# Altium schematic sheet ai cam1_Sheet_1.schdoc
size 845 x 599 mm; Name: A_A1; Symbol: A_A1; Device: A_A1; @Project Name: Sheet_1; REV: 1.0; Date: 2024-08-16; Sheet: 1/1; Draw By: kenchen9508; Company: Your Company; Convert to PCB: yes; Add into BOM: yes; @Page No: 1; @Page Count: 1; @Schematic Name: ai cam; @Board Name: ai cam; @Update Date: 2024-08-17; @Page Name: Sheet_1; @Create Time: 21:37:35; @Update Time: 14:32:11; @Create Date: 2024-08-16
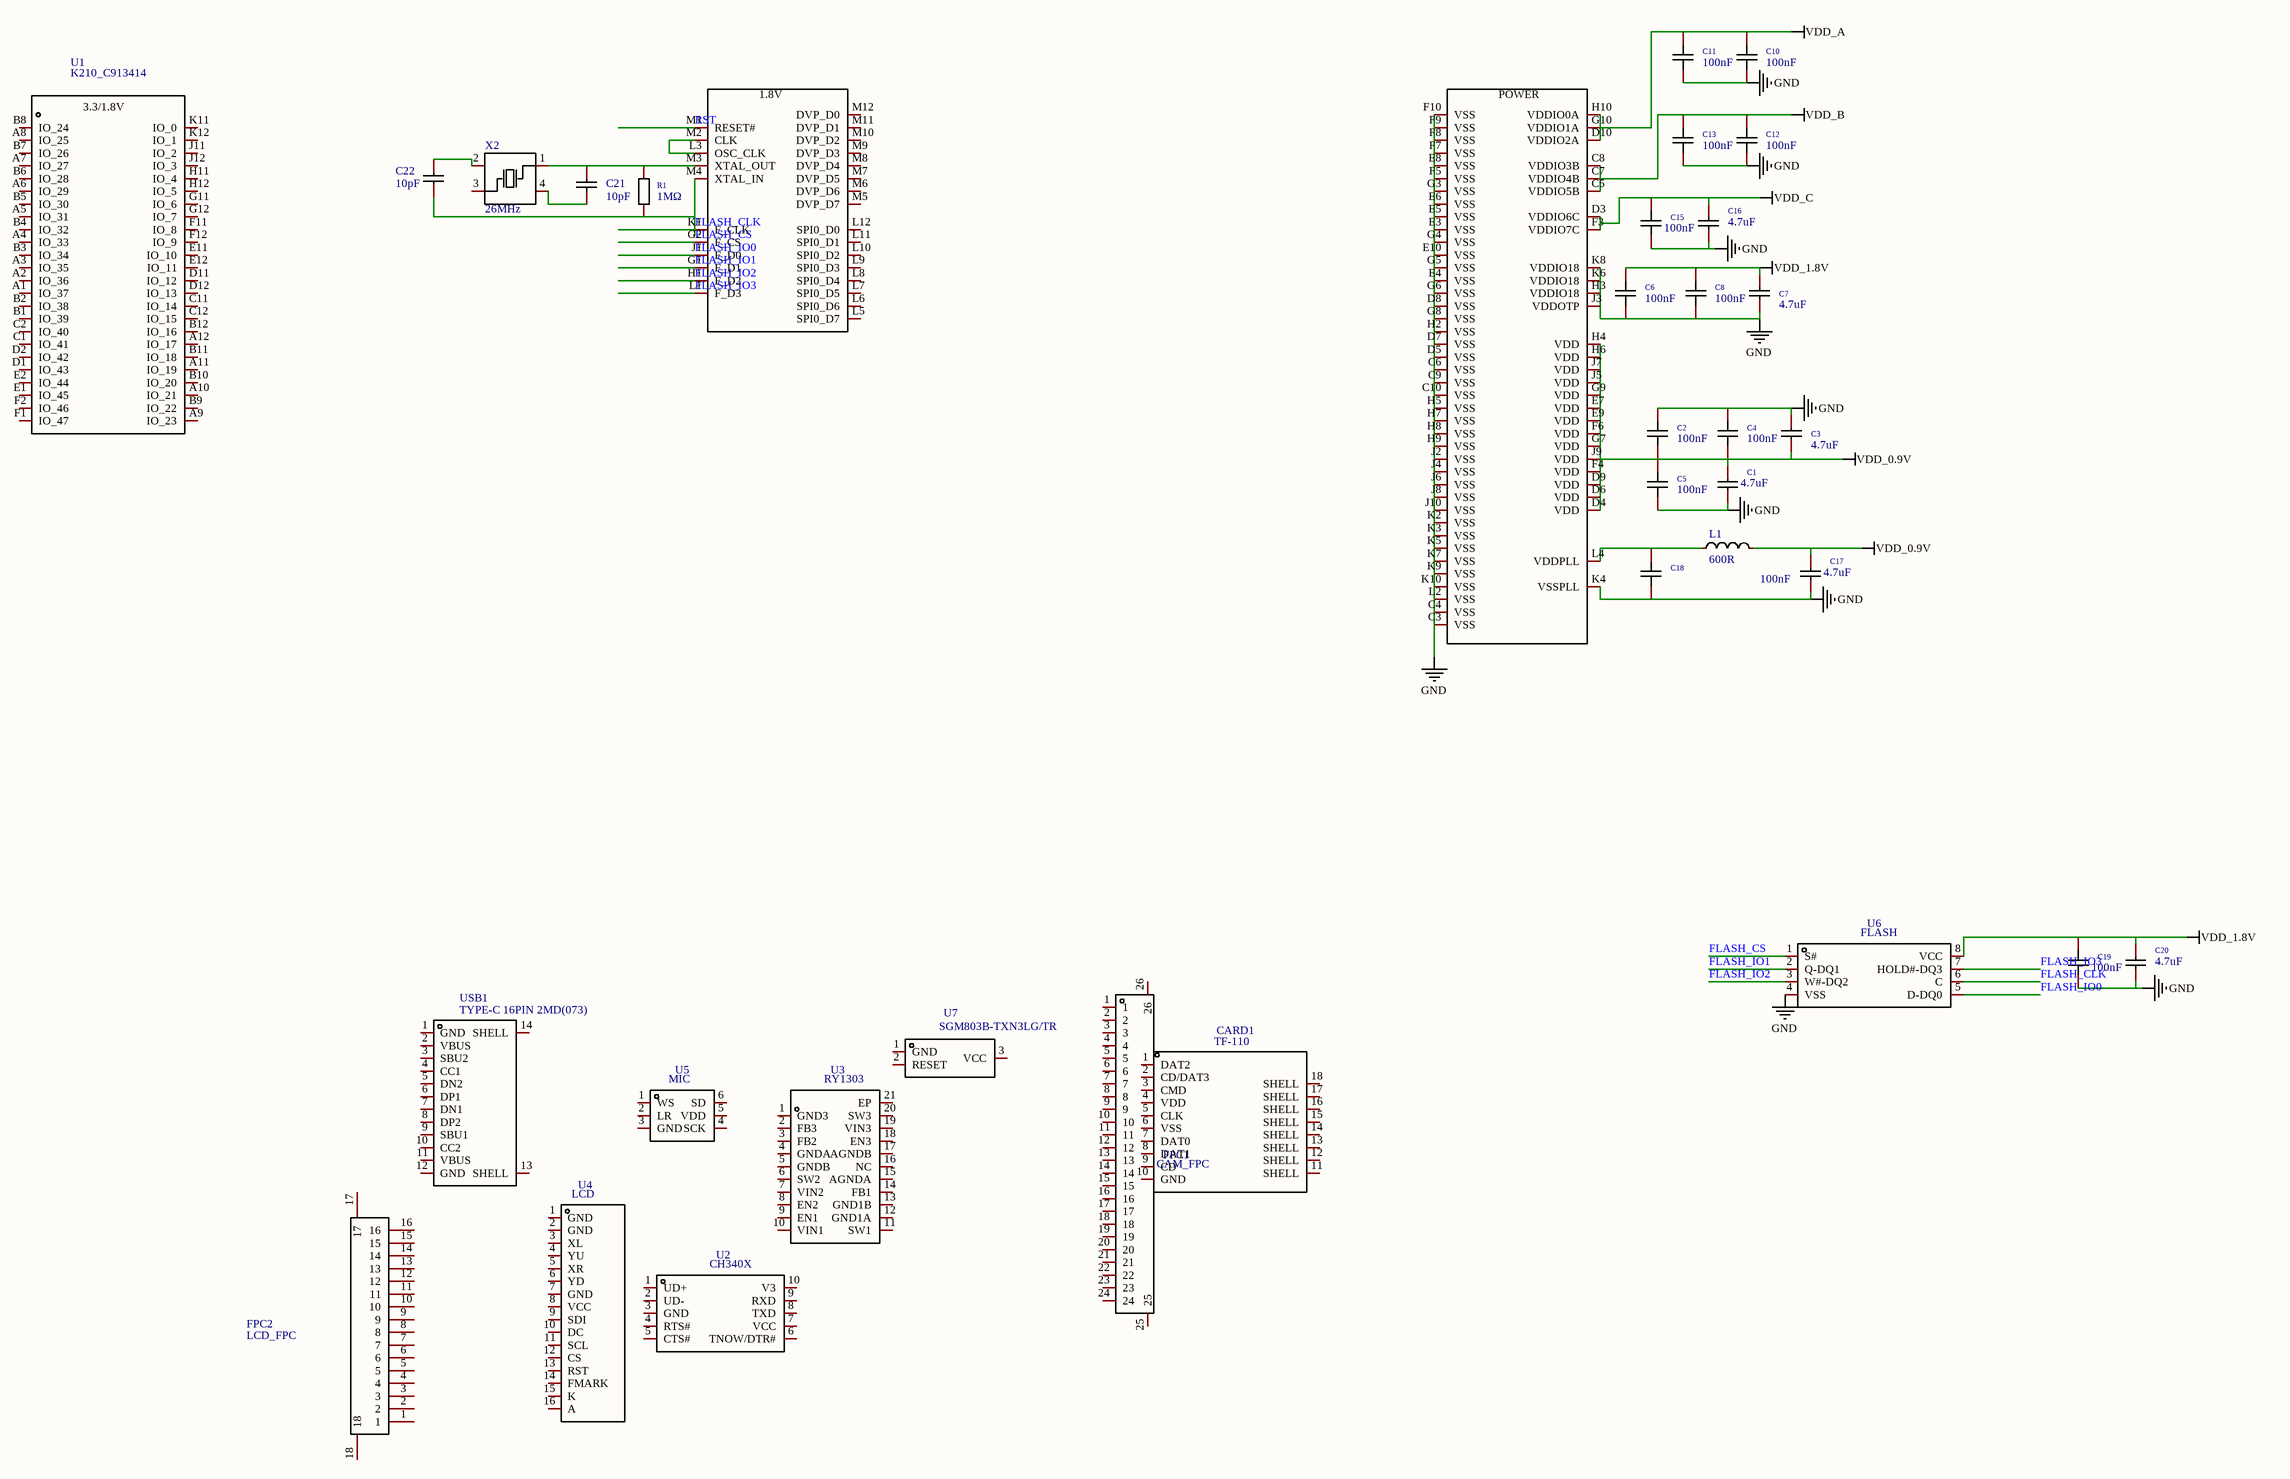
[diagram p0: ai cam1_Sheet_1.schdoc]

## Parts
C1  4.7uF  [C0402]  (value not drawn)
C2  100nF  [C0402]  (value not drawn)
C3  4.7uF  [C0402]  (value not drawn)
C4  100nF  [C0402]  (value not drawn)
C5  100nF  [C0402]  (value not drawn)
C6  100nF  [C0402]  (value not drawn)
C7  4.7uF  [C0402]  (value not drawn)
C8  100nF  [C0402]  (value not drawn)
C10  100nF  [C0402]  (value not drawn)
C11  100nF  [C0402]  (value not drawn)
C12  100nF  [C0402]  (value not drawn)
C13  100nF  [C0402]  (value not drawn)
C15  100nF  [C0402]  (value not drawn)
C16  4.7uF  [C0402]  (value not drawn)
C17  4.7uF  [C0402]  (value not drawn)
C18  100nF  [C0402]  (value not drawn)
C19  100nF  [C0402]  (value not drawn)
C20  4.7uF  [C0402]  (value not drawn)
C21  10pF  [C0402]  (value not drawn)
C22  10pF  [C0402]  (value not drawn)
CARD1  TF-110  (value not drawn)
FPC1  CAM_FPC  (value not drawn)
FPC2  LCD_FPC  (value not drawn)
L1  600R  [L0402]  (value not drawn)
R1  1MΩ  [R0402]  (value not drawn)
U1  K210_C913414  (value not drawn)
U2  CH340X  (value not drawn)
U3  RY1303  (value not drawn)
U4  LCD  (value not drawn)
U5  MIC  (value not drawn)
U6  FLASH  (value not drawn)
U7  SGM803B-TXN3LG/TR  (value not drawn)
USB1  TYPE-C 16PIN 2MD(073)  (value not drawn)
X2  26MHz  (value not drawn)

## Nets
GND: C1.1 C2.2 C3.2 C4.2 C5.1 C6.1 C7.1 C8.1 C10.1 C11.1 C12.1 C13.1 C15.1 C16.1 C17.1 C18.1 C19.1 C20.1 U1.C3(VSS) U1.C4(VSS) U1.C6(VSS) U1.C9(VSS) U1.C10(VSS) U1.D5(VSS) U1.D7(VSS) U1.D8(VSS) U1.E3(VSS) U1.E4(VSS) U1.E5(VSS) U1.E6(VSS) U1.E8(VSS) U1.E10(VSS) U1.F5(VSS) U1.F7(VSS) U1.F8(VSS) U1.F9(VSS) U1.F10(VSS) U1.G3(VSS) U1.G4(VSS) U1.G5(VSS) U1.G6(VSS) U1.G8(VSS) U1.H2(VSS) U1.H3(VDDIO18) U1.H5(VSS) U1.H7(VSS) U1.H8(VSS) U1.H9(VSS) U1.J2(VSS) U1.J3(VDDOTP) U1.J4(VSS) U1.J6(VSS) U1.J8(VSS) U1.J10(VSS) U1.K2(VSS) U1.K3(VSS) U1.K4(VSSPLL) U1.K5(VSS) U1.K6(VDDIO18) U1.K7(VSS) U1.K8(VDDIO18) U1.K9(VSS) U1.K10(VSS) U1.L2(VSS) U6.4(VSS)
VDD_0.9V: C1.2 C2.1 C3.1 C4.1 C5.2 C17.2 L1.2 U1.D4(VDD) U1.D6(VDD) U1.D9(VDD) U1.E7(VDD) U1.E9(VDD) U1.F4(VDD) U1.F6(VDD) U1.G7(VDD) U1.G9(VDD) U1.H4(VDD) U1.H6(VDD) U1.J5(VDD) U1.J7(VDD) U1.J9(VDD)
VDD_1.8V: C6.2 C7.2 C8.2 C19.2 C20.2 U6.8(VCC)
VDD_A: C10.2 C11.2 U1.D10(VDDIO2A) U1.G10(VDDIO1A) U1.H10(VDDIO0A)
VDD_B: C12.2 C13.2 U1.C5(VDDIO5B) U1.C7(VDDIO4B) U1.C8(VDDIO3B)
VDD_C: C15.2 C16.2 U1.D3(VDDIO6C) U1.F3(VDDIO7C)
FLASH_CLK: C22.1 R1.1 U1.K1(F_CLK) U1.M4(XTAL_IN) U6.6(C)
FLASH_CS: U1.G2(F_CS) U6.1(S#)
FLASH_IO0: U1.J1(F_D0) U6.5(D-DQ0)
FLASH_IO1: U1.G1(F_D1) U6.2(Q-DQ1)
FLASH_IO2: U1.H1(F_D2) U6.3(W#-DQ2)
FLASH_IO3: U1.L1(F_D3) U6.7(HOLD#-DQ3)
RST: U1.M1(RESET#)
NetC18_2: C18.2 L1.1 U1.L4(VDDPLL)
NetC21_1: C21.1 X2.4(GND)
NetC21_2: C21.2 R1.2 U1.M3(XTAL_OUT) X2.1(OSC1)
NetC22_2: C22.2 X2.2(GND)
NetU1_L3: U1.L3(OSC_CLK) U1.M2(CLK)

Not connected (* = marked no-connect by the designer): CARD1 1(DAT2) 2(CD/DAT3) 3(CMD) 4(VDD) 5(CLK) 6(VSS) 7(DAT0) 8(DAT1) 9(CD) 10(GND) 11(SHELL) 12(SHELL) 13(SHELL) 14(SHELL) 15(SHELL) 16(SHELL) 17(SHELL) 18(SHELL); FPC1 1 2 3 4 5 6 7 8 9 10 11 12 13 14 15 16 17 18 19 20 21 22 23 24 25 26; FPC2 1 2 3 4 5 6 7 8 9 10 11 12 13 14 15 16 17 18; U1 A1(IO_37) A2(IO_36) A3(IO_35) A4(IO_33) A5(IO_31) A6(IO_29) A7(IO_27) A8(IO_25) A9(IO_23) A10(IO_21) A11(IO_19) A12(IO_17) B1(IO_39) B2(IO_38) B3(IO_34) B4(IO_32) B5(IO_30) B6(IO_28) B7(IO_26) B8(IO_24) B9(IO_22) B10(IO_20) B11(IO_18) B12(IO_16) C1(IO_41) C2(IO_40) C11(IO_14) C12(IO_15) D1(IO_43) D2(IO_42) D11(IO_12) D12(IO_13) E1(IO_45) E2(IO_44) E11(IO_10) E12(IO_11) F1(IO_47) F2(IO_46) F11(IO_8) F12(IO_9) G11(IO_6) G12(IO_7) H11(IO_4) H12(IO_5) J11(IO_2) J12(IO_3) K11(IO_0) K12(IO_1) L5(SPI0_D7) L6(SPI0_D6) L7(SPI0_D5) L8(SPI0_D4) L9(SPI0_D3) L10(SPI0_D2) L11(SPI0_D1) L12(SPI0_D0) M5(DVP_D7) M6(DVP_D6) M7(DVP_D5) M8(DVP_D4) M9(DVP_D3) M10(DVP_D2) M11(DVP_D1) M12(DVP_D0); U2 1(UD+) 2(UD-) 3(GND) 4(RTS#) 5(CTS#) 6(TNOW/DTR#) 7(VCC) 8(TXD) 9(RXD) 10(V3); U3 1(GND3) 2(FB3) 3(FB2) 4(GNDA) 5(GNDB) 6(SW2) 7(VIN2) 8(EN2) 9(EN1) 10(VIN1) 11(SW1) 12(GND1A) 13(GND1B) 14(FB1) 15(AGNDA) 16(NC) 17(AGNDB) 18(EN3) 19(VIN3) 20(SW3) 21(EP); U4 1(GND) 2(GND) 3(XL) 4(YU) 5(XR) 6(YD) 7(GND) 8(VCC) 9(SDI) 10(DC) 11(SCL) 12(CS) 13(RST) 14(FMARK) 15(K) 16(A); U5 1(WS) 2(LR) 3(GND) 4(SCK) 5(VDD) 6(SD); U7 1(GND) 2(RESET) 3(VCC); USB1 1(GND) 2(VBUS) 3(SBU2) 4(CC1) 5(DN2) 6(DP1) 7(DN1) 8(DP2) 9(SBU1) 10(CC2) 11(VBUS) 12(GND) 13(SHELL) 14(SHELL); X2 3(OSC2)

## Notes on the sheet
- 1
- 2
- 3
- 4
- 5
- 6
- 7
- 8
- 9
- 10
- 11
- 12
- 13
- 14
- 15
- 16
- A
- B
- C
- D
- E
- F
- G
- H
- I
- J
- K
- TITLE:
- Sheet_1
- REV:
- 1.0
- Date:
- Company:
- 2024-08-16
- Your Company
- Drawn By:
- kenchen9508
- Sheet:
- 1/1
- (in symbol K210_C913414) 1.8V; POWER; 3.3/1.8V

## Library data of the parts
C1 C3 C7 C16 C17 C20 = CL05A475MP5NRNC: Capacitance: Tolerance:±20% Tolerance:±20% Voltage Rated: Temperature Coefficient:; Manufacturer: SAMSUNG(三星); Add into BOM: yes; Tolerance: ±20%; Symbol: CL05A475MP5NRNC; Device: CL05A475MP5NRNC; Supplier: LCSC; Manufacturer Part: CL05A475MP5NRNC; Value: 4.7uF; Supplier Part: C23733; LCSC Part Name: 4.7uF ±20% 10V; Supplier Footprint: 0402; Datasheet: https://atta.szlcsc.com/upload/public/pdf/source/20160218/1457707763339.pdf; Convert to PCB: yes
C2 C4-C6 C8 C10-C13 C15 C18 C19 = CC0402KRX7R7BB104: Capacitance: Tolerance:±10% Tolerance:±10% Voltage Rated: Temperature Coefficient:; Manufacturer: YAGEO(国巨); Add into BOM: yes; Tolerance: ±10%; Symbol: CC0402KRX7R7BB104; Device: CC0402KRX7R7BB104; Supplier: LCSC; Manufacturer Part: CC0402KRX7R7BB104; Value: 100nF; Supplier Part: C60474; JLCPCB Part Class: 扩展库; LCSC Part Name: 100nF ±10% 16V; Supplier Footprint: 0402; Datasheet: https://atta.szlcsc.com/upload/public/pdf/source/20211223/9278FD768280B81DDBEF48FA36411A03.pdf; Convert to PCB: yes
C21 C22 = 0402CG100J500NT: Capacitance: Tolerance:±5% Tolerance:±5% Voltage Rated: Temperature Coefficient:; Manufacturer: FH(风华); Add into BOM: yes; Tolerance: ±5%; Symbol: 0402CG100J500NT; Device: 0402CG100J500NT; LCSC Part Name: 10pF ±5% 50V; Supplier Part: C1545; Manufacturer Part: 0402CG100J500NT; Supplier Footprint: 0402; Datasheet: https://atta.szlcsc.com/upload/public/pdf/source/20200305/C486355_26A10D38EF8C2A5C37091D0039909270.pdf; Supplier: LCSC; Convert to PCB: yes; Value: 10pF
CARD1 = TF-110: Manufacturer: XUNPU(讯普); Convert to PCB: yes; Origin Footprint: TF-SMD_TF-110; Symbol: TF-110; Device: TF-110; Supplier: LCSC; Supplier Part: C266613; Manufacturer Part: TF-110; JLCPCB Part Class: Extended Part; Add into BOM: yes
FPC1 = CAM_FPC: Manufacturer: XUNPU(讯普); Manufacturer Part: FPC-05FB-24PH20; Convert to PCB: yes; Origin Footprint: FPC-SMD_24P-P0.50_FPC-05FB-24PH20; Symbol: CAM_FPC; Device: CAM_FPC; Supplier: LCSC; Supplier Part: C2856831; JLCPCB Part Class: Extended Part; Add into BOM: yes
FPC2 = LCD_FPC: Manufacturer: JS(钜硕电子); Manufacturer Part: AFC01-S16FCA-00; Convert to PCB: yes; Origin Footprint: FPC-SMD_P0.50-16P_FGS-XJ-H2.0; Symbol: LCD_FPC; Device: LCD_FPC; Supplier: LCSC; Supplier Part: C262665; JLCPCB Part Class: Extended Part; Add into BOM: yes
L1 = BLM15AG601SN1D: Impedance @ Frequency:600Ω@100MHz Tolerance:±25% Tolerance:±25% DC Resistance:520mΩ Current Rating:300mA Circuits:1; Manufacturer: muRata(村田); Add into BOM: yes; Tolerance: ±25%; DC Resistance: 520mΩ; Current Rating: 300mA; Circuits: 1; Symbol: BLM15AG601SN1D; Device: BLM15AG601SN1D; LCSC Part Name: 单路 0402磁珠 阻抗600Ω@100MHz; Supplier Part: C76884; Manufacturer Part: BLM15AG601SN1D; Supplier Footprint: 0402; JLCPCB Part Class: 扩展库; Datasheet: https://atta.szlcsc.com/upload/public/pdf/source/20181120/C333978_3E581FB55966932B05020139ABDE8E01.pdf; Supplier: LCSC; Convert to PCB: yes; Impedance @ Frequency: 600Ω@100MHz
R1 = 0402WGF1004TCE: Type:Thick Film Resistors Resistance:1MΩ Tolerance:±1% Tolerance:±1% Power(Watts): Overload Voltage (Max): Temperature Coefficient:±100ppm/℃ Temperature Coefficient:±100ppm/℃ Operating Temperature Range:-55℃~+155℃ Operating Temperature Range:-55℃~+155℃; Manufacturer: UNI-ROYAL(厚声); Add into BOM: yes; Tolerance: ±1%; Symbol: 0402WGF1004TCE; Device: 0402WGF1004TCE; Supplier: LCSC; Manufacturer Part: 0402WGF1004TCE; Supplier Part: C26083; Value: 1MΩ; JLCPCB Part Class: 基础库; LCSC Part Name: 1MΩ ±1% 62.5mW 厚膜电阻; Supplier Footprint: 0402; Datasheet: https://atta.szlcsc.com/upload/public/pdf/source/20200306/C422600_1E6D84923E4A46A82E41ADD87F860B5C.pdf; Convert to PCB: yes; Type: Thick Film Resistors; Temperature Coefficient: ±100ppm/℃; Operating Temperature Range: -55℃~+155℃
U1 = K210_C913414: Manufacturer: Canaan(嘉楠); Manufacturer Part: k210; Convert to PCB: yes; Origin Footprint: BGA-144_L8.0-W8.0-R12-C12-P0.65-BL; Symbol: K210_C913414; Device: K210_C913414; Supplier: LCSC; Supplier Part: C913414; JLCPCB Part Class: Extended Part; Add into BOM: yes
U2 = CH340X: Manufacturer: WCH(南京沁恒); Convert to PCB: yes; Origin Footprint: MSOP-10_L3.0-W3.0-P0.50-LS5.0-BL; Symbol: CH340X; Device: CH340X; Supplier: LCSC; Supplier Part: C3035748; Manufacturer Part: CH340X; JLCPCB Part Class: Extended Part; Add into BOM: yes
U3 = RY1303: Manufacturer: RYCHiP(蕊源); Convert to PCB: yes; Origin Footprint: QFN-20_L3.0-W3.0-P0.40-BL-EP1.9; Symbol: RY1303; Device: RY1303; Supplier: LCSC; Supplier Part: C370881; Manufacturer Part: RY1303; JLCPCB Part Class: Extended Part; Add into BOM: yes
U4 = LCD: Manufacturer: HS(汉昇); Manufacturer Part: HS24CG003-ARX; Convert to PCB: yes; Origin Footprint: LCD-SMD_HS24CG003-ARX; Symbol: LCD; Device: LCD; Supplier: LCSC; Supplier Part: C5329583; JLCPCB Part Class: Extended Part; Add into BOM: yes
U5 = MIC: Manufacturer: TDK InvenSense(应美盛); Manufacturer Part: ICS-43434; Convert to PCB: yes; Origin Footprint: MIC-SMD_6P-L3.5-W2.7-P0.90-BL; Symbol: MIC; Device: MIC; Supplier: LCSC; Supplier Part: C5656610; JLCPCB Part Class: Extended Part; Add into BOM: yes
U6 = FLASH: Manufacturer: ST(意法半导体); Manufacturer Part: M95P32-IXMNT/E; Convert to PCB: yes; Origin Footprint: SO-8_L4.9-W3.9-P1.27-LS6.0-BL; Symbol: FLASH; Device: FLASH; Supplier: LCSC; Supplier Part: C5267629; JLCPCB Part Class: Extended Part; Add into BOM: yes
U7 = SGM803B-TXN3LG/TR: Manufacturer: SGMICRO(圣邦微); Convert to PCB: yes; Origin Footprint: SOT-23-3_L2.9-W1.3-P0.95-LS2.4-BR; Symbol: SGM803B-TXN3LG/TR; Device: SGM803B-TXN3LG/TR; Supplier: LCSC; Supplier Part: C699599; Manufacturer Part: SGM803B-TXN3LG/TR; JLCPCB Part Class: Extended Part; Add into BOM: yes
USB1 = TYPE-C 16PIN 2MD(073): Manufacturer: SHOU HAN(首韩); Convert to PCB: yes; Origin Footprint: USB-C-SMD_TYPE-C-6PIN-2MD-073; Symbol: TYPE-C 16PIN 2MD(073); Device: TYPE-C 16PIN 2MD(073); Supplier: LCSC; Supplier Part: C2765186; Manufacturer Part: TYPE-C 16PIN 2MD(073); JLCPCB Part Class: Extended Part; Add into BOM: yes
X2 = 26MHz: Manufacturer: YXC(扬兴晶振); Manufacturer Part: X252026MLB4SI; Convert to PCB: yes; Origin Footprint: CRYSTAL-SMD_4P-L2.5-W2.0-BL-A; Symbol: 26MHz; Device: 26MHz; Supplier: LCSC; Supplier Part: C371131; JLCPCB Part Class: Extended Part; Add into BOM: yes